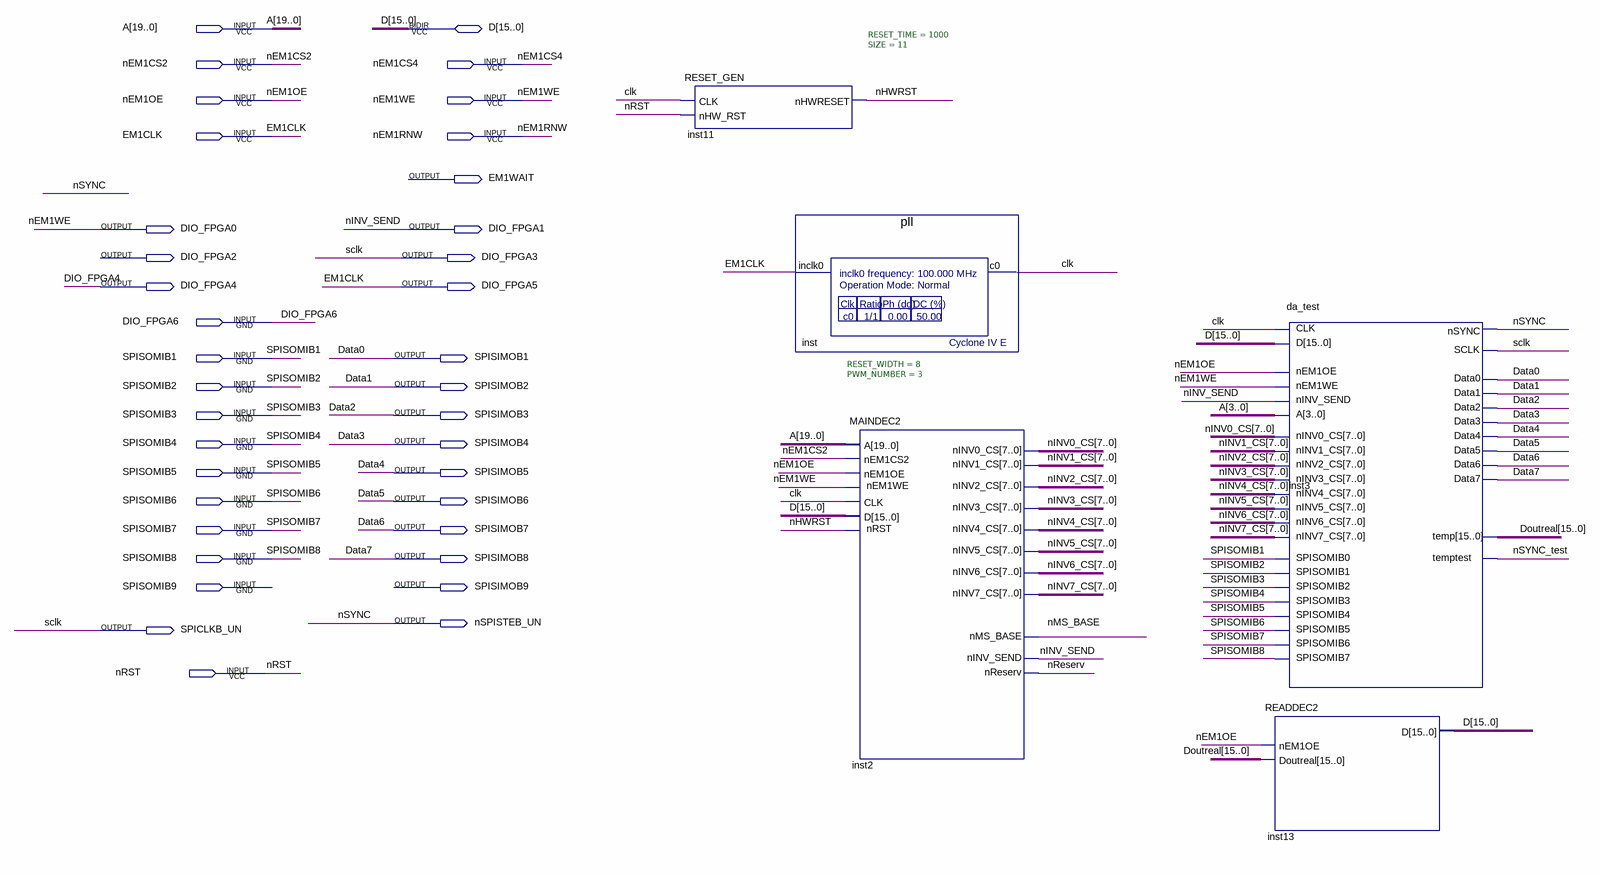
[diagram p0: schematic sheet]
// Quartus schematic FPGA_20140329.bdf as structural Verilog: 5 symbols, 37 pins
module FPGA_20140329 (
  input  [19:0] A,
  input  nEM1CS2,
  input  nEM1CS4,
  input  nEM1OE,
  input  nEM1WE,
  input  EM1CLK,
  input  nEM1RNW,
  input  DIO_FPGA6,
  input  SPISOMIB1,
  input  SPISOMIB2,
  input  SPISOMIB3,
  input  SPISOMIB4,
  input  SPISOMIB5,
  input  SPISOMIB6,
  input  SPISOMIB7,
  input  SPISOMIB8,
  input  SPISOMIB9,
  input  nRST,
  inout  [15:0] D,
  output EM1WAIT,
  output DIO_FPGA0,
  output DIO_FPGA1,
  output DIO_FPGA2,
  output DIO_FPGA3,
  output DIO_FPGA4,
  output DIO_FPGA5,
  output SPISIMOB1,
  output SPISIMOB2,
  output SPISIMOB3,
  output SPISIMOB4,
  output SPISIMOB5,
  output SPISIMOB6,
  output SPISIMOB7,
  output SPISIMOB8,
  output SPISIMOB9,
  output nSPISTEB_UN,
  output SPICLKB_UN
);

  wire clk, nHWRST, nMS_BASE, nReserv, nSYNC_test;
  wire [7:0] nINV0_CS, nINV1_CS, nINV2_CS, nINV3_CS, nINV4_CS, nINV5_CS, nINV6_CS, nINV7_CS;
  wire [15:0] Doutreal;

  RESET_GEN #(.RESET_TIME(1000), .SIZE(11)) inst11 (.CLK(clk), .nHW_RST(nRST), .nHWRESET(nHWRST));
  pll inst (.inclk0(EM1CLK), .c0(clk));
  MAINDEC2 #(.RESET_WIDTH(8), .PWM_NUMBER(3)) inst2 (
    .CLK(clk), .nRST(nHWRST), .A(A), .D(D), .nEM1CS2(nEM1CS2), .nEM1OE(nEM1OE), .nEM1WE(nEM1WE),
    .nMS_BASE(nMS_BASE), .nINV_SEND(DIO_FPGA1), .nReserv(nReserv), .nINV0_CS(nINV0_CS), .nINV1_CS(nINV1_CS),
    .nINV2_CS(nINV2_CS), .nINV3_CS(nINV3_CS), .nINV4_CS(nINV4_CS), .nINV5_CS(nINV5_CS), .nINV6_CS(nINV6_CS),
    .nINV7_CS(nINV7_CS));
  READDEC2 inst13 (.Doutreal(Doutreal), .nEM1OE(nEM1OE), .D(D));
  da_test inst3 (
    .CLK(clk), .SPISOMIB1(SPISOMIB2), .nEM1OE(nEM1OE), .nEM1WE(nEM1WE), .nINV_SEND(DIO_FPGA1), .A(A[3:0]),
    .SPISOMIB0(SPISOMIB1), .SPISOMIB2(SPISOMIB3), .SPISOMIB3(SPISOMIB4), .SPISOMIB4(SPISOMIB5),
    .SPISOMIB5(SPISOMIB6), .SPISOMIB6(SPISOMIB7), .SPISOMIB7(SPISOMIB8), .nINV1_CS(nINV1_CS),
    .nINV0_CS(nINV0_CS), .nINV2_CS(nINV2_CS), .nINV3_CS(nINV3_CS), .nINV4_CS(nINV4_CS), .nINV5_CS(nINV5_CS),
    .nINV6_CS(nINV6_CS), .nINV7_CS(nINV7_CS), .nSYNC(nSPISTEB_UN), .SCLK(DIO_FPGA3), .temp(Doutreal),
    .temptest(nSYNC_test), .Data0(SPISIMOB1), .Data1(SPISIMOB2), .Data2(SPISIMOB3), .Data3(SPISIMOB4),
    .Data4(SPISIMOB5), .Data5(SPISIMOB6), .Data6(SPISIMOB7), .Data7(SPISIMOB8), .D(D));

  assign DIO_FPGA0 = nEM1WE;
  assign DIO_FPGA5 = EM1CLK;
  assign SPICLKB_UN = DIO_FPGA3;

  // Other names for the same wires on the sheet: Data0 = SPISIMOB1; Data1 = SPISIMOB2; Data2 = SPISIMOB3;
  //   Data3 = SPISIMOB4; Data4 = SPISIMOB5; Data5 = SPISIMOB6; Data6 = SPISIMOB7; Data7 = SPISIMOB8;
  //   nINV_SEND = DIO_FPGA1; nSYNC = nSPISTEB_UN; sclk = DIO_FPGA3
endmodule
